# EAGLE design digit_3 (EAGLE 6.6.0)
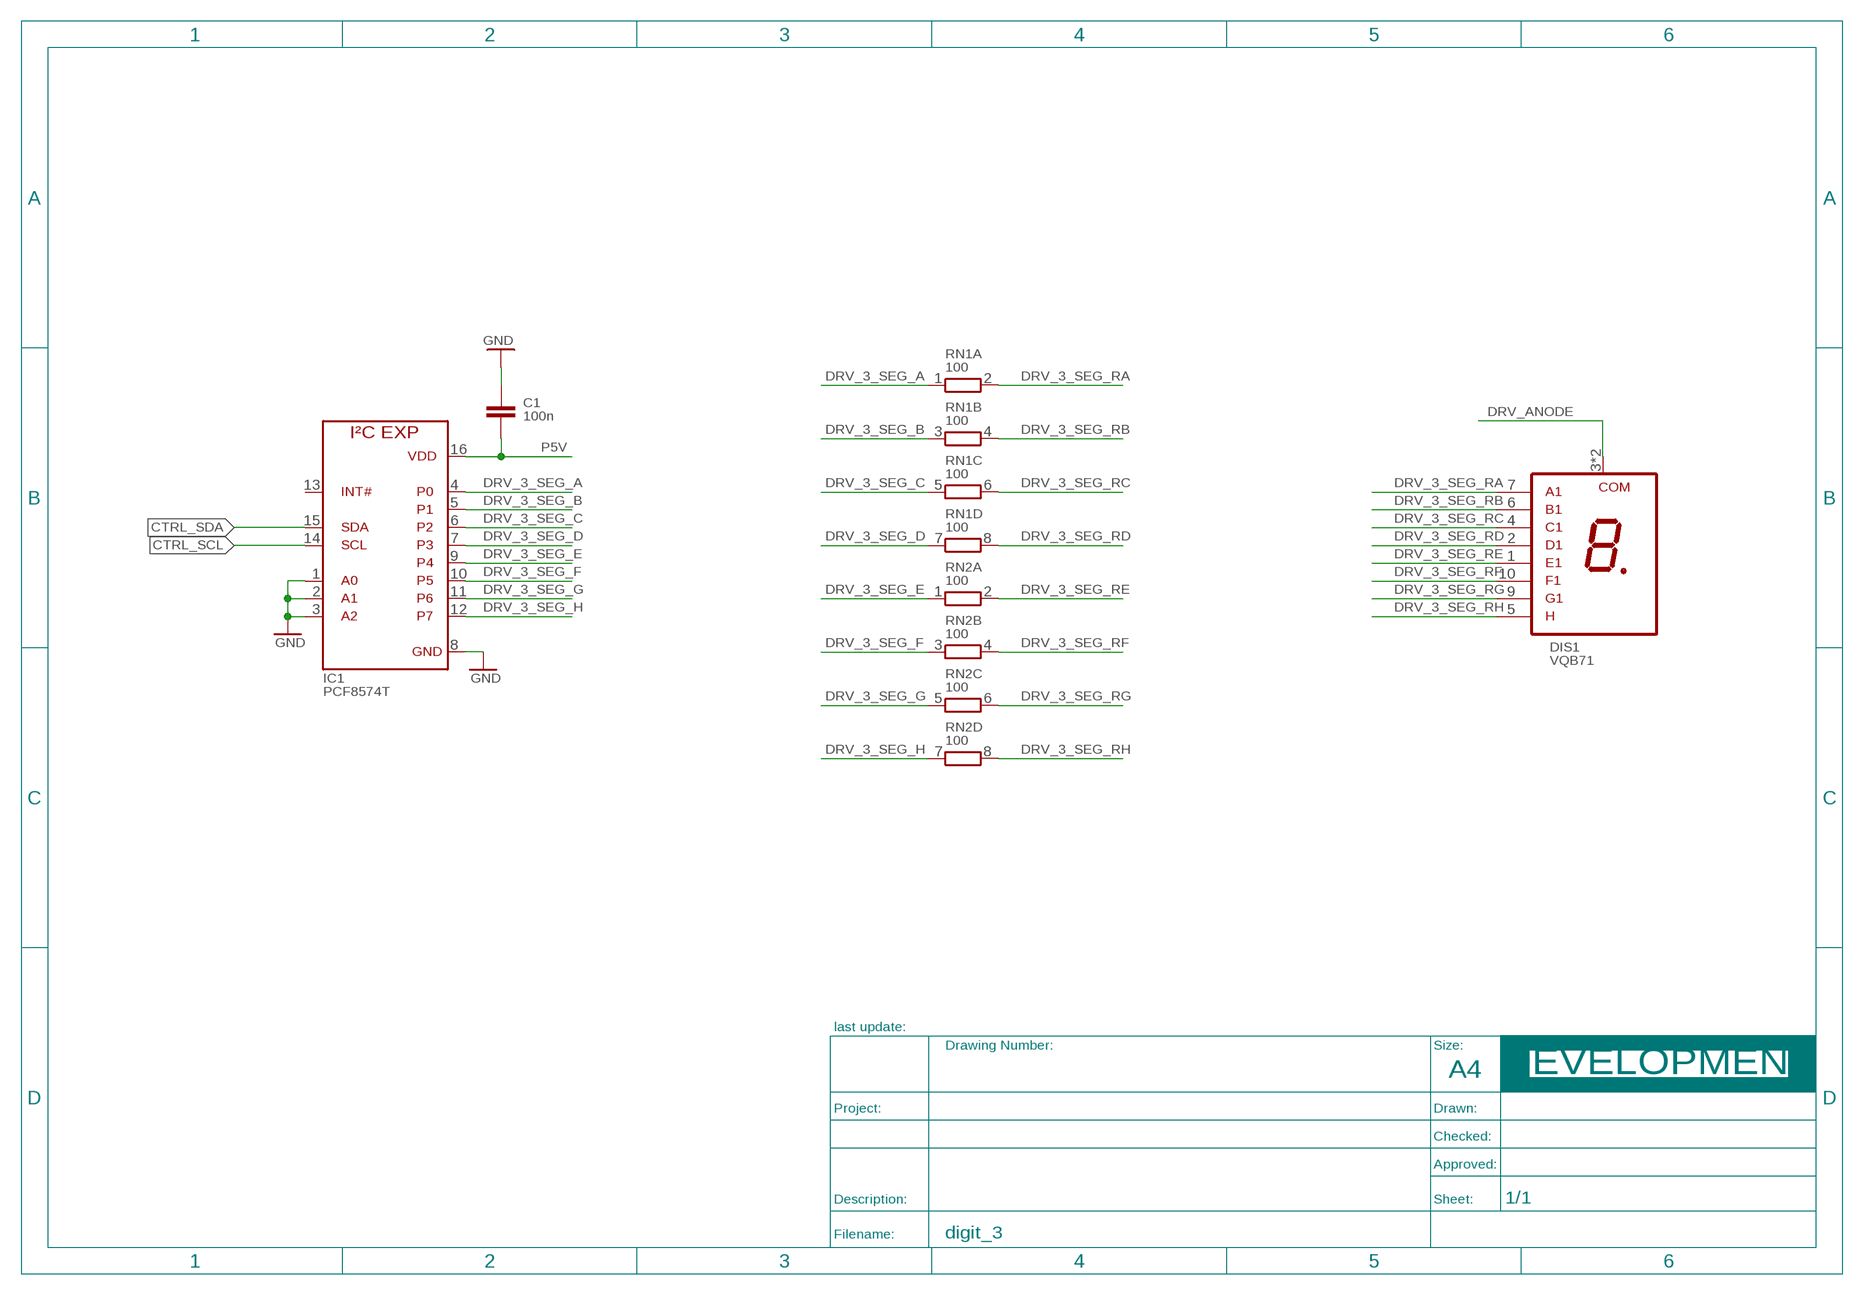
[diagram p0: schematic, sheet 1]
FRAME_PRODUCT1 (A4_LANDSCAPE_DEVELOPMENT): BOM: NO; COMMISSIONED: 2013-08-30

## Parts
C1  100n  C_EU_S_0805  [S_0805]
DIS1  VQB71  [T_VQB71]
IC1  PCF8574T  [S_SOIC16]
RN1  100  R_EU_ARRAY_4  [T_SIL8]
RN2  100  R_EU_ARRAY_4  [T_SIL8]

## Nets
CTRL_SCL [pwr]: IC1.14(SCL)
CTRL_SDA [pwr]: IC1.15(SDA)
DRV_3_SEG_A: IC1.4(P0) RN1.1
DRV_3_SEG_B: IC1.5(P1) RN1.3
DRV_3_SEG_C: IC1.6(P2) RN1.5
DRV_3_SEG_D: IC1.7(P3) RN1.7
DRV_3_SEG_E: IC1.9(P4) RN2.1
DRV_3_SEG_F: IC1.10(P5) RN2.3
DRV_3_SEG_G: IC1.11(P6) RN2.5
DRV_3_SEG_H: IC1.12(P7) RN2.7
DRV_3_SEG_RA: DIS1.7(A1) RN1.2
DRV_3_SEG_RB: DIS1.6(B1) RN1.4
DRV_3_SEG_RC: DIS1.4(C1) RN1.6
DRV_3_SEG_RD: DIS1.2(D1) RN1.8
DRV_3_SEG_RE: DIS1.1(E1) RN2.2
DRV_3_SEG_RF: DIS1.10(F1) RN2.4
DRV_3_SEG_RG: DIS1.9(G1) RN2.6
DRV_3_SEG_RH: DIS1.5(DP1) RN2.8
DRV_ANODE [pwr]: DIS1.3(COM1) DIS1.8(COM1)
GND [pwr]: C1.1 IC1.1(A0) IC1.2(A1) IC1.3(A2) IC1.8(GND)
P5V [pwr]: C1.2 IC1.16(VDD)
Unconnected: IC1.13(!INT)

## Library data of the parts
C1 = be_rcl:C_EU: drawn: Mario Blunk / Blunk electronic; BOM: YES; COMMISSIONED: 2013-08-30; PART_CODE_BEL: C_PAC_S_0805_VAL_100n
DIS1 = be_opt:VQB71: edited: Mario Blunk / Blunk electronic; BOM: YES; COMMISSIONED: 2015-10-02; PART_CODE_EXT: DIS_PAC_T_VQE71_VAL_VQE71
IC1 = be_i2c:PCF8574: edited: Mario Blunk / Blunk electronic; BOM: YES; COMMISSIONED: 2015-10-14; PART_CODE_BEL: IC_PAC_S_SIOC16_VAL_PCF8574T
RN1 RN2 = be_rcl:R_EU_ARRAY_4: edited: Mario Blunk / Blunk electronic; BOM: YES; COMMISSIONED: 2014-10-14; PART_CODE_BEL: RN_PAC_T_SIL8_VAL_100; UPDATED: 2015-10-14

## Net classes
1 pwr: width 0.3 mm

## Board
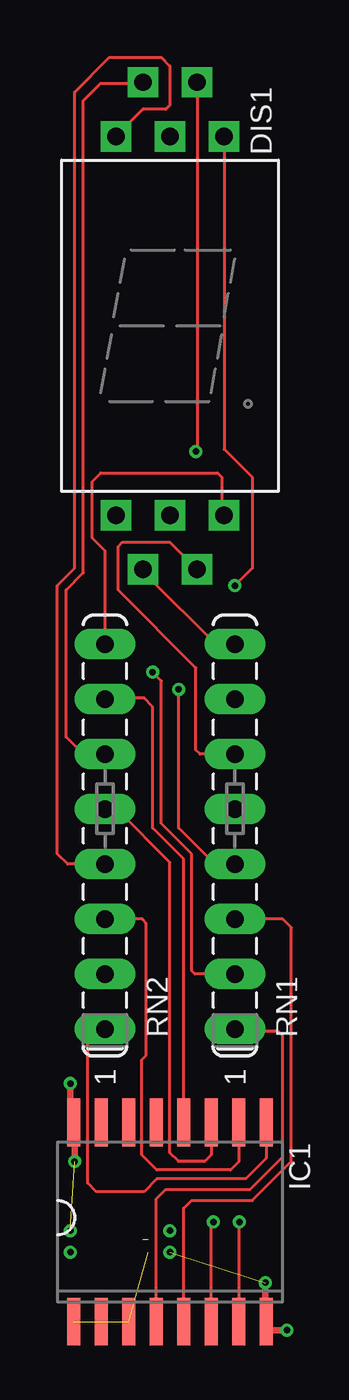
[diagram p1: board, top side]
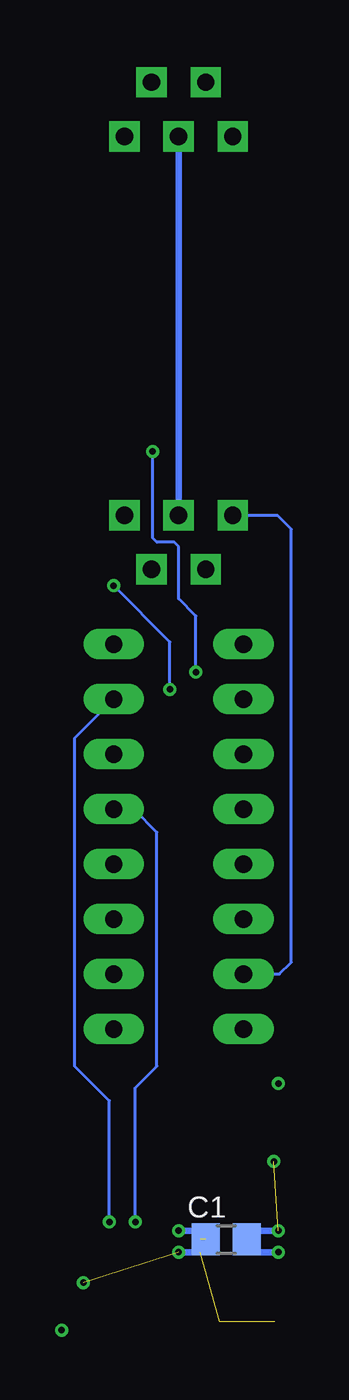
[diagram p2: board, bottom side, seen from below]

No outline drawn. Coordinates in mm, seen from the top.
Copper layers (1*16): Top 0.035mm / dielectric 1.6mm / Bottom 0.035mm
Design rules "JLP_BL_std": minimum track width 0.15mm, minimum drill 0.3mm, track to track 0.15mm, track to pad 0.15mm, pad to pad 0.15mm, via to via 0.15mm, smd to smd 0.15mm, copper to edge 0.5mm, drill to drill 0.2mm, minimum pad ring 0.3mm, minimum via ring 0.15mm, stop-mask expansion 0.075mm, vias tented up to drill 0.3mm, thermal gap 0.2mm

### Footprints (pad centres in the part's own frame; a part is rotated, then mirrored left to right if it is on the bottom)
S_0805 = smd 1.3 x 1.5: 1 -0.95,0; 2 0.95,0
T_VQB71 = drill 0.8 square: 1 -2.5,-8.75; 2 -1.25,-11.25; 3 0,-8.75; 4 1.25,-11.25; 5 2.5,-8.75; 6 2.5,8.75; 7 1.25,11.25; 8 0,8.75; 9 -1.25,11.25; 10 -2.5,8.75
S_SOIC16 = smd 0.6 x 2.2: 1 -4.445,-4.6; 2 -3.175,-4.6; 3 -1.905,-4.6; 4 -0.635,-4.6; 5 0.635,-4.6; 6 1.905,-4.6; 7 3.175,-4.6; 8 4.445,-4.6; 9 4.445,4.6; 10 3.175,4.6; 11 1.905,4.6; 12 0.635,4.6; 13 -0.635,4.6; 14 -1.905,4.6; 15 -3.175,4.6; 16 -4.445,4.6
T_SIL8 = drill 0.8 long: 1 -8.89,0; 2 -6.35,0; 3 -3.81,0; 4 -1.27,0; 5 1.27,0; 6 3.81,0; 7 6.35,0; 8 8.89,0

### Placement (x,y rotation side)
C1  5.8,7.6 0 bottom
DIS1  8,49.8 0 top
IC1  8,8.4 0 top
RN1  11,26.2 90 top
RN2  5,26.2 90 top

### Tracks (layer width: path | path; a pad name or v marks a point on that pad's centre or on a via)
DRV_3_SEG_A
  Top 0.15: IC1.4 7.37,9.46 7.8,9.9 11.7,9.9 13.2,11.4 13.2,17 13,17.2 11.11,17.2 RN1.1
DRV_3_SEG_B
  Top 0.15: IC1.5 8.63,9.04 9,9.4 11.8,9.4 13.6,11.2 13.6,22 13.2,22.4 RN1.3
DRV_3_SEG_C  (via drill 0.3)
  Top 0.15: IC1.6 9.9,8.3 v10,8.4
  Bottom 0.15: v10,8.4 10,14.6 9,15.6 9,26.4 10,27.4 10.93,27.4 RN1.5
DRV_3_SEG_D  (via drill 0.3)
  Top 0.15: IC1.7 11.2,3.83 v11.2,8.4
  Bottom 0.15: v11.2,8.4 11.2,14 12.8,15.6 12.8,30.75 RN1.7
DRV_3_SEG_E
  Top 0.15: IC1.9 12.45,11.35 11.5,10.4 7.4,10.4 6.8,9.8 4.6,9.8 4.2,10.2 4.2,17.31 RN2.1
DRV_3_SEG_F
  Top 0.15: IC1.10 11.18,11.18 10.8,10.8 7.4,10.8 6.7,11.5 6.7,15.9 6.9,16.1 6.9,22.2 6.71,22.39 RN2.3
DRV_3_SEG_G
  Top 0.15: IC1.11 9.9,11.51 9.6,11.2 8.4,11.2 8,11.6 8,25 5.6,27.4 5.07,27.4 RN2.5
DRV_3_SEG_H
  Top 0.15: IC1.12 8.63,25.16 7.2,26.6 7.2,32.2 6.8,32.6 5.05,32.6 RN2.7
DRV_3_SEG_RA  (via drill 0.3)
  Top 0.15: RN1.2 9.15,19.85 9,20 9,25.4 7.6,26.8 7.6,33.4 v7.2,33.8 | DIS1.7 9.25,44.05 v9.2,44
  Bottom 0.15: v7.2,33.8 7.2,36.4 8,37.2 8,39.6 8.2,39.8 9,39.8 9.2,40 v9.2,44
DRV_3_SEG_RB  (via drill 0.3)
  Top 0.15: RN1.4 10.07,24.93 8.4,26.6 v8.4,33 | DIS1.6 10.5,44.1 11.8,42.8 11.8,38.6 v11,37.8
  Bottom 0.15: v8.4,33 8.4,35.2 v11,37.8
DRV_3_SEG_RC
  Top 0.15: RN1.6 9.39,30.01 9.2,30.2 9.2,34 5.6,37.6 5.6,39.6 5.8,39.8 8,39.8 DIS1.4
DRV_3_SEG_RD
  Top 0.15: RN1.8 10.11,35.09 7,38.2 6.8,38.5 DIS1.2
DRV_3_SEG_RE
  Bottom 0.15: RN2.2 3.35,19.85 2.8,20.4 2.8,40.4 3.45,41.05 DIS1.1
DRV_3_SEG_RF
  Top 0.15: RN2.4 3.27,24.93 2.8,25.4 2.8,37.8 3.6,38.6 3.6,60.6 5.2,62.2 7.6,62.2 8,61.8 8,60 7.8,59.8 6.75,59.8 DIS1.10
DRV_3_SEG_RG
  Top 0.15: RN2.6 3.99,30.01 3.2,30.8 3.2,37.6 4,38.4 4,60.2 4.8,61 6.7,61 DIS1.9
DRV_3_SEG_RH
  Top 0.15: RN2.8 5,39.4 4.4,40 4.4,42.6 4.8,43 10.2,43 10.4,42.8 10.4,41.15 DIS1.5
DRV_ANODE
  Bottom 0.3: DIS1.3 DIS1.8
GND  (via drill 0.3)  (5 unrouted)
  Top 0.3: v12.4,5.6 12.4,3.85 IC1.8 12.45,3.4 v13.4,3.4
  Bottom 0.3: C1.1 6.75,8 v8,8 | 7,7.6 7,7 v8,7
P5V  (via drill 0.3)  (1 unrouted)
  Top 0.3: v3.4,14.8 3.4,13 IC1.16 3.6,13 v3.6,11.2
  Bottom 0.3: v3.4,8 4.45,8 C1.2 4.25,7 v3.4,7